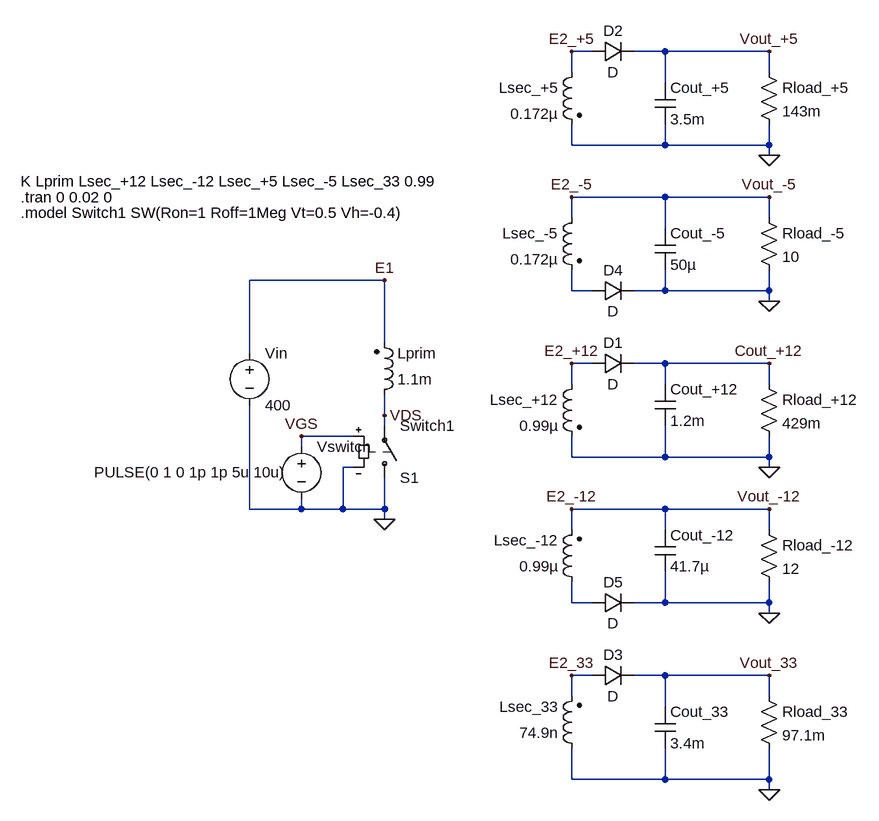
[diagram p0: schematic BasicFlyBack_AllRails.asc]
BasicFlyBack_AllRails.asc, the LTspice schematic file:
Version 4
SHEET 1 880 1024
WIRE 48 -192 16 -192
WIRE 160 -192 112 -192
WIRE 320 -192 160 -192
WIRE 16 -160 16 -192
WIRE 320 -160 320 -192
WIRE 160 -144 160 -192
WIRE 16 -48 16 -80
WIRE 160 -48 160 -80
WIRE 160 -48 16 -48
WIRE 320 -48 320 -80
WIRE 320 -48 160 -48
WIRE 320 -32 320 -48
WIRE 160 32 16 32
WIRE 320 32 160 32
WIRE 16 64 16 32
WIRE 320 64 320 32
WIRE 160 80 160 32
WIRE -272 160 -480 160
WIRE 16 176 16 144
WIRE 48 176 16 176
WIRE 160 176 160 144
WIRE 160 176 112 176
WIRE 320 176 320 144
WIRE 320 176 160 176
WIRE 320 192 320 176
WIRE -272 256 -272 160
WIRE -480 272 -480 160
WIRE 48 288 16 288
WIRE 160 288 112 288
WIRE 320 288 160 288
WIRE 16 320 16 288
WIRE 160 320 160 288
WIRE 320 320 320 288
WIRE -272 368 -272 336
WIRE -272 384 -272 368
WIRE -320 400 -400 400
WIRE -400 416 -400 400
WIRE 16 432 16 400
WIRE 160 432 160 384
WIRE 160 432 16 432
WIRE 320 432 320 400
WIRE 320 432 160 432
WIRE -320 448 -336 448
WIRE 320 448 320 432
WIRE -480 512 -480 352
WIRE -400 512 -400 496
WIRE -400 512 -480 512
WIRE -336 512 -336 448
WIRE -336 512 -400 512
WIRE -272 512 -272 464
WIRE -272 512 -336 512
WIRE 160 512 16 512
WIRE 320 512 160 512
WIRE -272 528 -272 512
WIRE 16 544 16 512
WIRE 160 544 160 512
WIRE 320 544 320 512
WIRE 16 656 16 624
WIRE 48 656 16 656
WIRE 160 656 160 608
WIRE 160 656 112 656
WIRE 320 656 320 624
WIRE 320 656 160 656
WIRE 320 672 320 656
WIRE 48 768 16 768
WIRE 160 768 112 768
WIRE 320 768 160 768
WIRE 16 800 16 768
WIRE 320 800 320 768
WIRE 160 816 160 768
WIRE 16 928 16 880
WIRE 160 928 160 880
WIRE 160 928 16 928
WIRE 320 928 320 880
WIRE 320 928 160 928
WIRE 320 944 320 928
FLAG -272 528 0
FLAG 320 944 0
FLAG 320 -32 0
FLAG 320 448 0
FLAG -272 160 E1
FLAG 16 288 E2_+12
FLAG 16 -192 E2_+5
FLAG 16 768 E2_33
FLAG 320 288 Cout_+12
FLAG 320 -192 Vout_+5
FLAG 320 768 Vout_33
FLAG -400 400 VGS
FLAG -272 368 VDS
FLAG 320 192 0
FLAG 16 32 E2_-5
FLAG 320 32 Vout_-5
FLAG 320 672 0
FLAG 16 512 E2_-12
FLAG 320 512 Vout_-12
SYMBOL voltage -480 256 R0
SYMATTR InstName Vin
SYMATTR Value 400
SYMBOL ind2 -288 352 M180
WINDOW 0 36 80 Left 2
WINDOW 3 36 40 Left 2
SYMATTR InstName Lprim
SYMATTR Value 1.1m
SYMATTR Type ind
SYMATTR SpiceLine Rser=1m
SYMBOL ind2 32 304 M0
SYMATTR InstName Lsec_+12
SYMATTR Value 0.99µ
SYMATTR Type ind
SYMATTR SpiceLine Rser=1m
SYMBOL ind2 32 -176 M0
SYMATTR InstName Lsec_+5
SYMATTR Value 0.172µ
SYMATTR Type ind
SYMATTR SpiceLine Rser=1m
SYMBOL ind2 32 896 R180
WINDOW 0 36 80 Left 2
WINDOW 3 36 40 Left 2
SYMATTR InstName Lsec_33
SYMATTR Value 74.9n
SYMATTR Type ind
SYMATTR SpiceLine Rser=1m
SYMBOL sw -272 480 M180
SYMATTR InstName S1
SYMATTR Value Switch1
SYMBOL voltage -400 400 R0
WINDOW 3 -319 55 Left 2
WINDOW 123 0 0 Left 0
WINDOW 39 0 0 Left 0
SYMATTR Value PULSE(0 1 0 1p 1p 5u 10u)
SYMATTR InstName Vswitch
SYMBOL res 304 304 R0
SYMATTR InstName Rload_+12
SYMATTR Value 429m
SYMBOL res 304 -176 R0
SYMATTR InstName Rload_+5
SYMATTR Value 143m
SYMBOL res 304 784 R0
SYMATTR InstName Rload_33
SYMATTR Value 97.1m
SYMBOL cap 144 816 R0
SYMATTR InstName Cout_33
SYMATTR Value 3.4m
SYMBOL cap 144 -144 R0
SYMATTR InstName Cout_+5
SYMATTR Value 3.5m
SYMBOL cap 144 320 R0
SYMATTR InstName Cout_+12
SYMATTR Value 1.2m
SYMBOL diode 48 304 R270
WINDOW 0 32 32 VTop 2
WINDOW 3 0 32 VBottom 2
SYMATTR InstName D1
SYMBOL diode 48 -176 R270
WINDOW 0 32 32 VTop 2
WINDOW 3 0 32 VBottom 2
SYMATTR InstName D2
SYMBOL diode 48 784 R270
WINDOW 0 32 32 VTop 2
WINDOW 3 0 32 VBottom 2
SYMATTR InstName D3
SYMBOL ind2 32 48 M0
SYMATTR InstName Lsec_-5
SYMATTR Value 0.172µ
SYMATTR Type ind
SYMATTR SpiceLine Rser=1m
SYMBOL res 304 48 R0
SYMATTR InstName Rload_-5
SYMATTR Value 10
SYMBOL cap 144 80 R0
SYMATTR InstName Cout_-5
SYMATTR Value 50µ
SYMBOL diode 48 192 R270
WINDOW 0 32 32 VTop 2
WINDOW 3 0 32 VBottom 2
SYMATTR InstName D4
SYMBOL ind2 32 640 R180
WINDOW 0 36 80 Left 2
WINDOW 3 36 40 Left 2
SYMATTR InstName Lsec_-12
SYMATTR Value 0.99µ
SYMATTR Type ind
SYMATTR SpiceLine Rser=1m
SYMBOL res 304 528 R0
SYMATTR InstName Rload_-12
SYMATTR Value 12
SYMBOL cap 144 544 R0
SYMATTR InstName Cout_-12
SYMATTR Value 41.7µ
SYMBOL diode 48 672 R270
WINDOW 0 32 32 VTop 2
WINDOW 3 0 32 VBottom 2
SYMATTR InstName D5
TEXT -832 8 Left 2 !K Lprim Lsec_+12 Lsec_-12 Lsec_+5 Lsec_-5 Lsec_33 0.99
TEXT -832 32 Left 2 !.tran 0 0.02 0
TEXT -832 56 Left 2 !.model Switch1 SW(Ron=1 Roff=1Meg Vt=0.5 Vh=-0.4)

The netlist it stands for:
* BasicFlyBack_AllRails.asc
Vin E1 0 400
Lprim VDS E1 1.1m Rser=1m
Lsec_+12 E2_+12 0 0.99µ Rser=1m
Lsec_+5 E2_+5 0 0.172µ Rser=1m
Lsec_33 0 E2_33 74.9n Rser=1m
S1 0 VDS VGS 0 Switch1
Vswitch VGS 0 PULSE(0 1 0 1p 1p 5u 10u)
Rload_+12 Cout_+12 0 429m
Rload_+5 Vout_+5 0 143m
Rload_33 Vout_33 0 97.1m
Cout_33 Vout_33 0 3.4m
Cout_+5 Vout_+5 0 3.5m
Cout_+12 Cout_+12 0 1.2m
D1 E2_+12 Cout_+12 D
D2 E2_+5 Vout_+5 D
D3 E2_33 Vout_33 D
Lsec_-5 Vout_-5 N001 0.172µ Rser=1m
Rload_-5 Vout_-5 0 10
Cout_-5 Vout_-5 0 50µ
D4 N001 0 D
Lsec_-12 N002 Vout_-12 0.99µ Rser=1m
Rload_-12 Vout_-12 0 12
Cout_-12 Vout_-12 0 41.7µ
D5 N002 0 D
.model D D
.lib standard.dio
K Lprim Lsec_+12 Lsec_-12 Lsec_+5 Lsec_-5 Lsec_33 0.99
.tran 0 0.02 0
.model Switch1 SW(Ron=1 Roff=1Meg Vt=0.5 Vh=-0.4)
.backanno
.end